# Altium schematic sheet Sheet1.SchDoc
size A
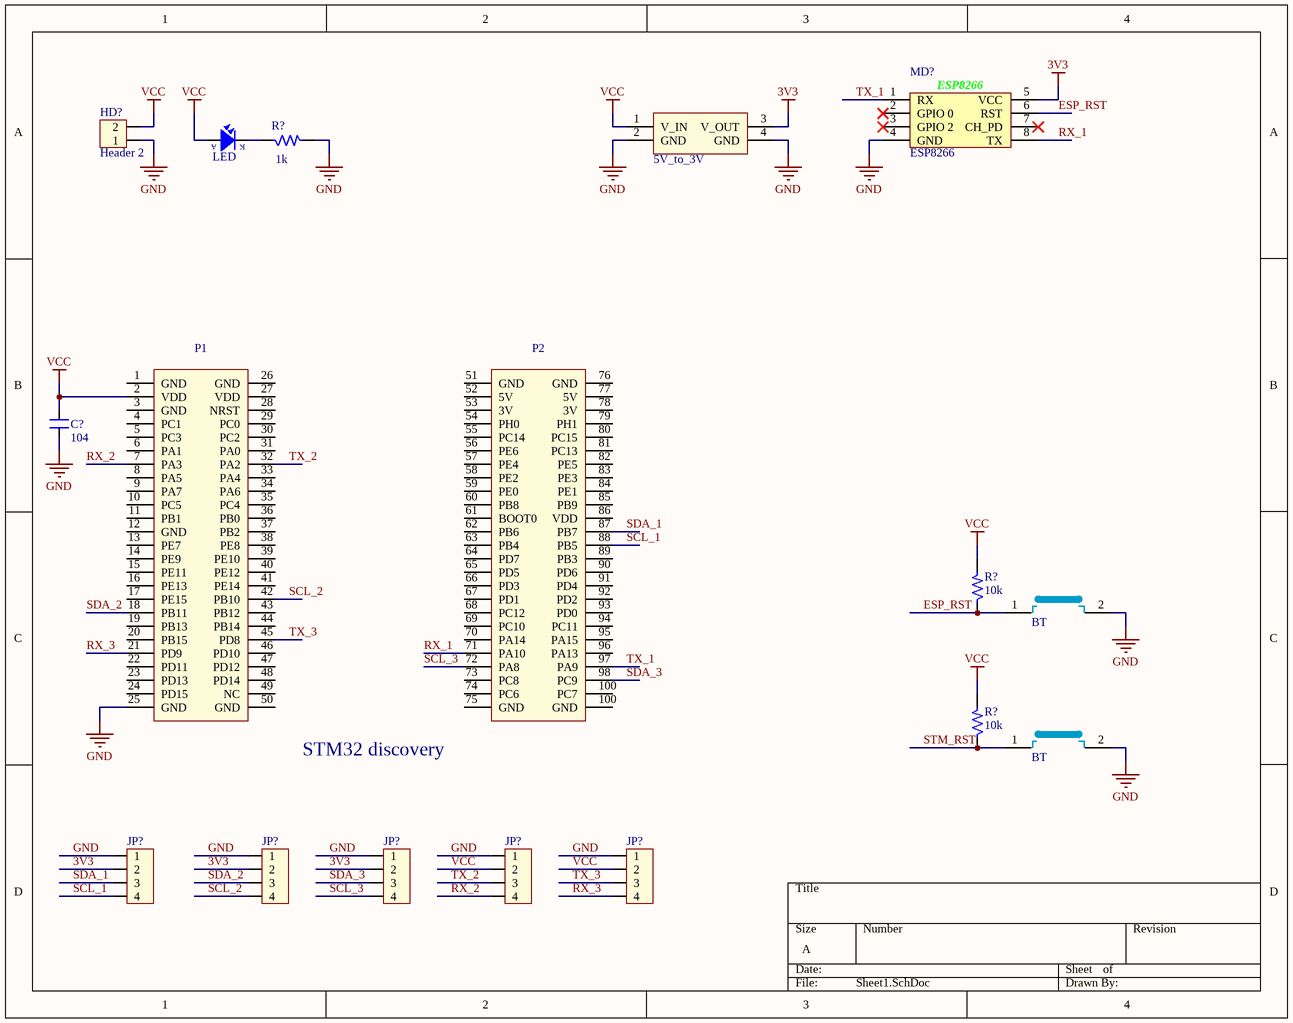
[diagram p0: Sheet1.SchDoc]

## Parts
(Parts that share a designator on the sheet are numbered #1, #2 ... from top to bottom, then left to right.)
AMS  5V_to_3V
BT?#1  BT  [SW4]
BT?#2  BT  [SW4]
C?  104  [CN2]
HD?  Header 2  [HED2]
JP?#1  JP4  [CON4]  (value not drawn)
JP?#2  JP4  [CON4]  (value not drawn)
JP?#3  JP4  [CON4]  (value not drawn)
JP?#4  JP4  [CON4]  (value not drawn)
JP?#5  JP4  [CON4]  (value not drawn)
LED?  LED  [LED-3]
MD?  ESP8266  [ESP2866]
R?#1  1k  [R1/4W]
R?#2  10k  [R1/4W]
R?#3  10k  [R1/4W]
STM32  STM32_F4  (value not drawn)

## Nets
3V3: AMS.3(V_OUT) JP?#1.2 JP?#2.2 JP?#3.2 MD?.5(VCC)
GND: AMS.2(GND) AMS.4(GND) BT?#1.2 BT?#2.2 C?.1 HD?.1 JP?#1.1 JP?#2.1 JP?#3.1 JP?#4.1 JP?#5.1 MD?.4(GND) R?#1.2 STM32.25(GND)
VCC: AMS.1(V_IN) C?.2 HD?.2 JP?#4.2 JP?#5.2 LED?.1(A) R?#2.2 R?#3.2 STM32.2(VDD)
ESP_RST: BT?#1.1 MD?.6(RST) R?#2.1
RX_1: MD?.8(TX) STM32.71(PA10)
RX_2: JP?#4.4 STM32.7(PA3)
RX_3: JP?#5.4 STM32.21(PD9)
SCL_1: JP?#1.4 STM32.88(PB5)
SCL_2: JP?#2.4 STM32.42(PB10)
SCL_3: JP?#3.4 STM32.72(PA8)
SDA_1: JP?#1.3 STM32.87(PB7)
SDA_2: JP?#2.3 STM32.18(PB11)
SDA_3: JP?#3.3 STM32.98(PC9)
STM_RST: BT?#2.1 R?#3.1
TX_1: MD?.1(RX) STM32.97(PA9)
TX_2: JP?#4.3 STM32.32(PA2)
TX_3: JP?#5.3 STM32.45(PD8)
NetLED?_2: LED?.2(K) R?#1.1

Not connected (* = marked no-connect by the designer): MD? 2(GPIO_0)* 3(GPIO_2)* 7(CH_PD)*; STM32 1(GND) 3(GND) 4(PC1) 5(PC3) 6(PA1) 8(PA5) 9(PA7) 10(PC5) 11(PB1) 12(GND) 13(PE7) 14(PE9) 15(PE11) 16(PE13) 17(PE15) 19(PB13) 20(PB15) 22(PD11) 23(PD13) 24(PD15) 26(GND) 27(VDD) 28(NRST) 29(PC0) 30(PC2) 31(PA0) 33(PA4) 34(PA6) 35(PC4) 36(PB0) 37(PB2) 38(PE8) 39(PE10) 40(PE12) 41(PE14) 43(PB12) 44(PB14) 46(PD10) 47(PD12) 48(PD14) 49(NC) 50(GND) 51(GND) 52(5V) 53(3V) 54(PH0) 55(PC14) 56(PE6) 57(PE4) 58(PE2) 59(PE0) 60(PB8) 61(BOOT0) 62(PB6) 63(PB4) 64(PD7) 65(PD5) 66(PD3) 67(PD1) 68(PC12) 69(PC10) 70(PA14) 73(PC8) 74(PC6) 75(GND) 76(GND) 77(5V) 78(3V) 79(PH1) 80(PC15) 81(PC13) 82(PE5) 83(PE3) 84(PE1) 85(PB9) 86(VDD) 89(PB3) 90(PD6) 91(PD4) 92(PD2) 93(PD0) 94(PC11) 95(PA15) 96(PA13) 100(PC7)

## Notes on the sheet
- (in symbol STM32_F4) P1; P2; STM32 discovery

## Library data of the parts
BT?#1 BT?#2 = BUTTON
C? = CN2: Cap np 104 => 105pF; Value: 0.1uF
HD? = Header 2: Header 2 (Green); Value: Header 2
JP?#1-JP?#5 = Con4: Connector 4; Value: Connector 4
LED? = LED: LED Single colour Green and Red; Value: LED 3 ly Single Colour
R?#1-R?#3 = Res